# Altium schematic sheet SC_ControlV2.0.SchDoc
size A2
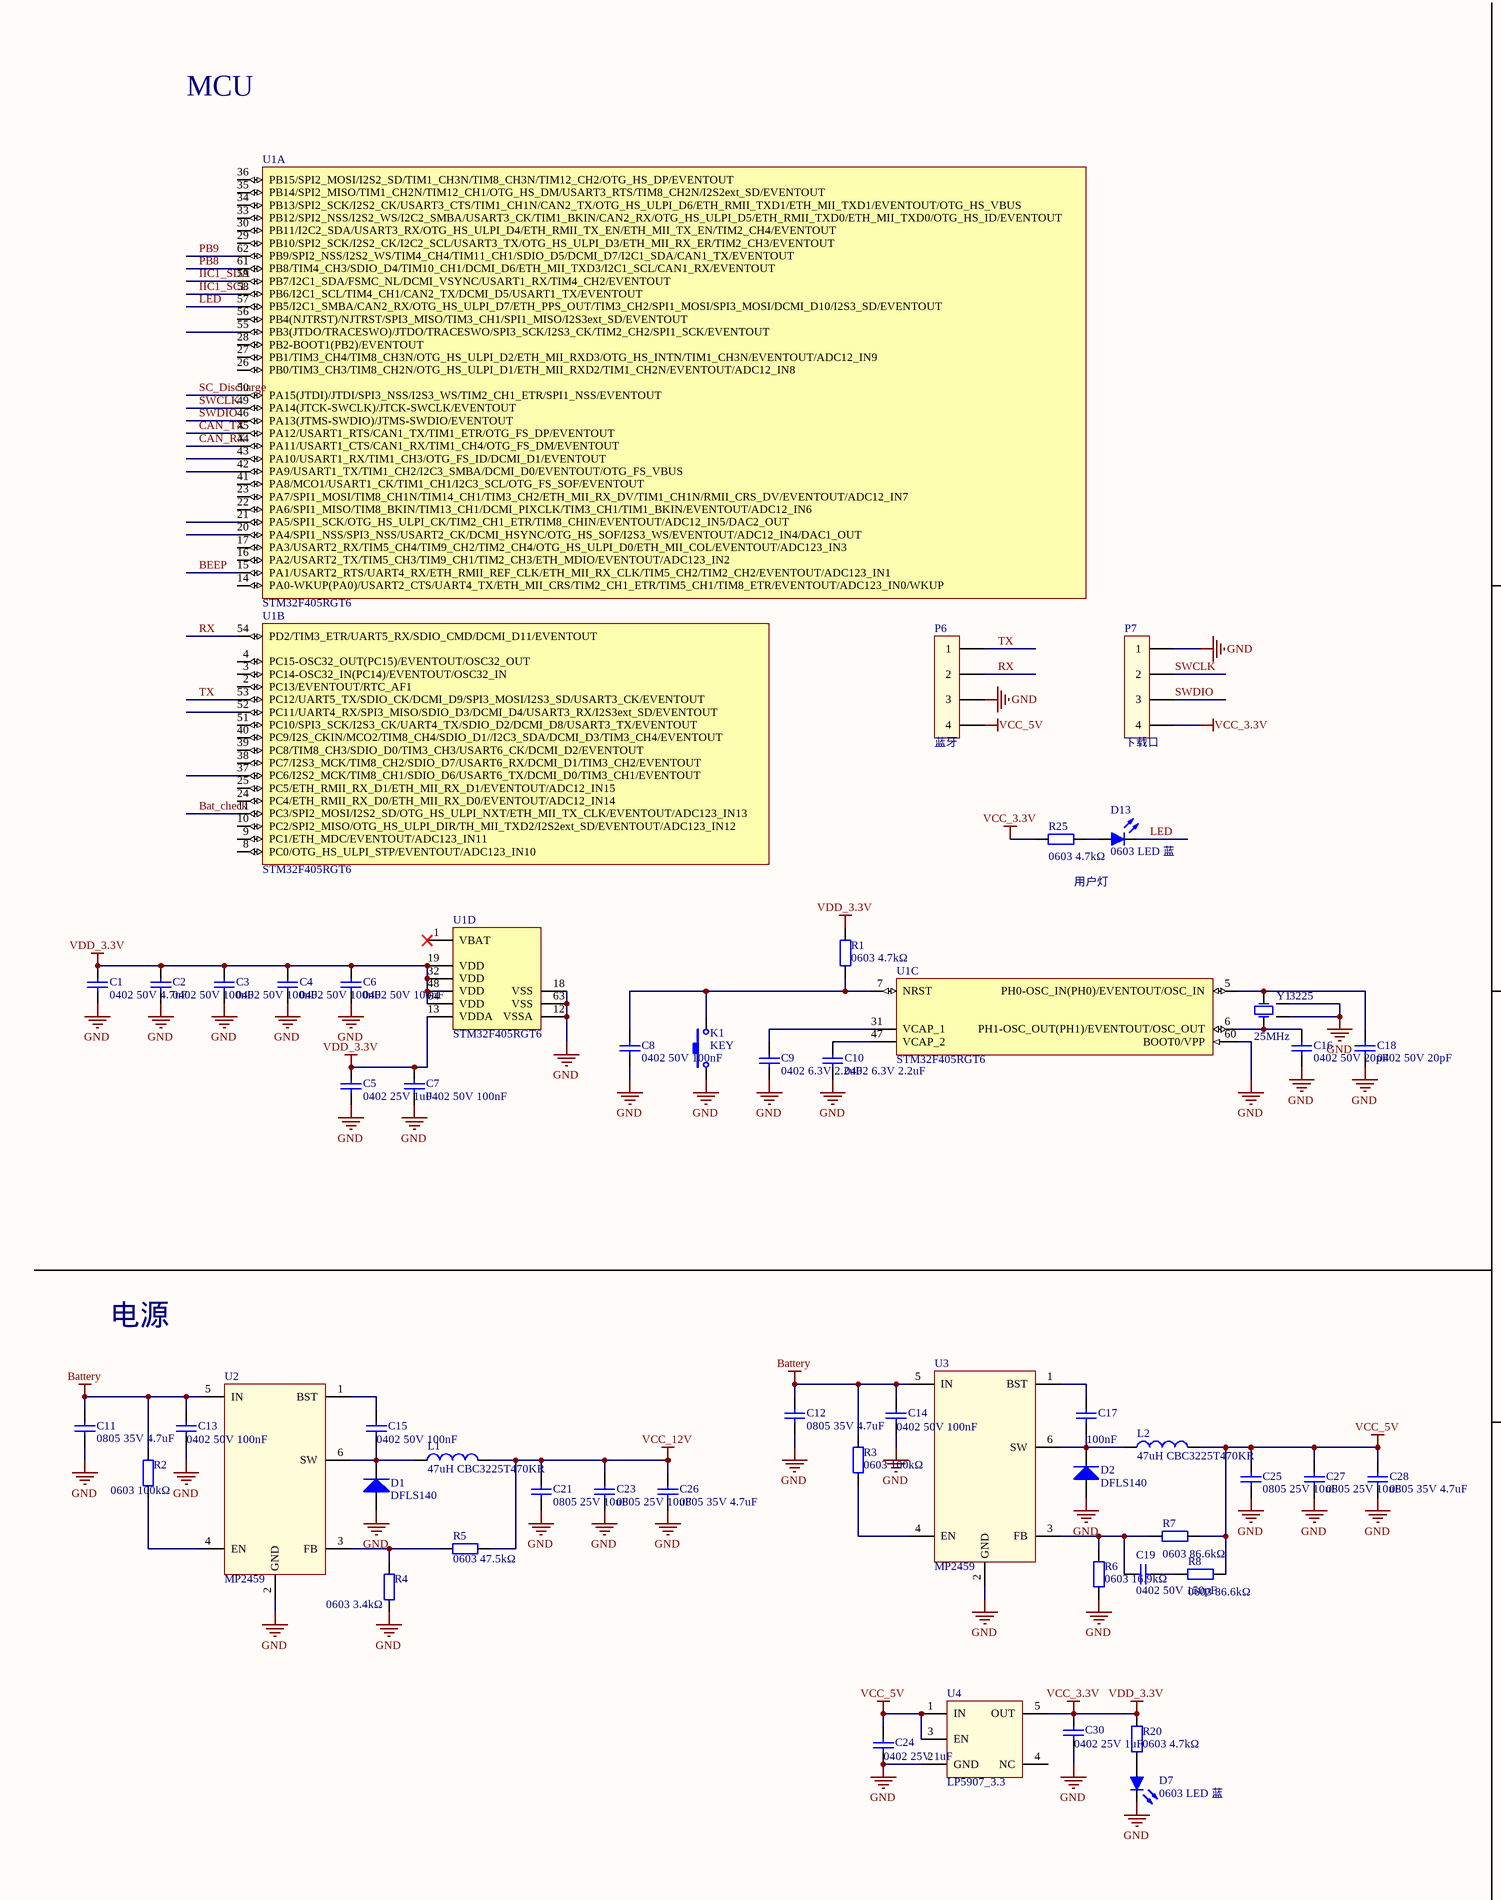
[diagram p0: SC_ControlV2.0.SchDoc, left]
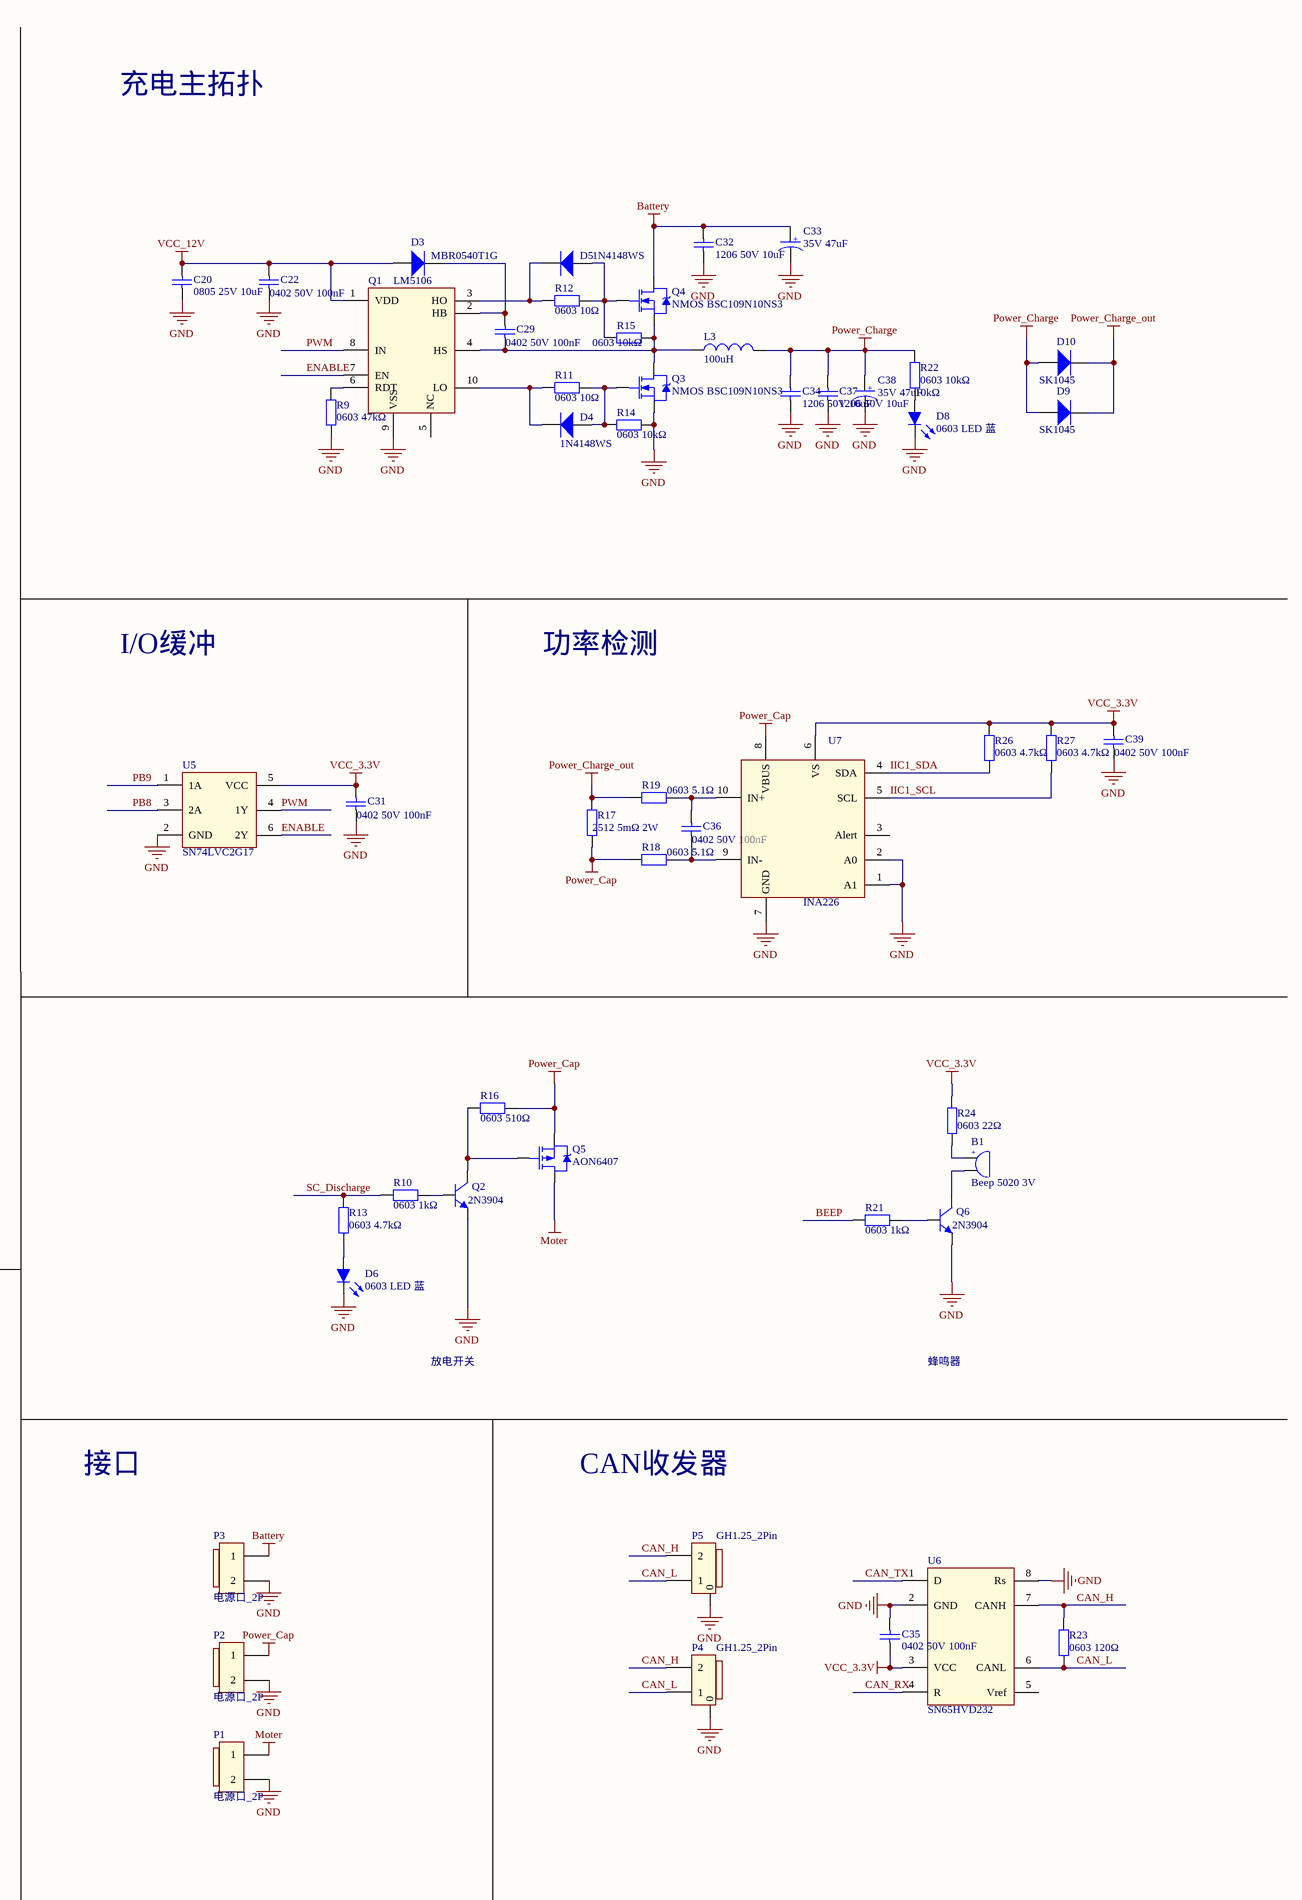
[diagram p1: SC_ControlV2.0.SchDoc, right]

## Parts
B1  Beep 5020 3V  [Beep 5020]
C1  0402 50V 4.7uF  [0402_C]
C2  0402 50V 100nF  [0402_C]
C3  0402 50V 100nF  [0402_C]
C4  0402 50V 100nF  [0402_C]
C5  0402 25V 1uF  [0402_C]
C6  0402 50V 100nF  [0402_C]
C7  0402 50V 100nF  [0402_C]
C8  0402 50V 100nF  [0402_C]
C9  0402 6.3V 2.2uF  [0402_C]
C10  0402 6.3V 2.2uF  [0402_C]
C11  0805 35V 4.7uF  [0805_C]
C12  0805 35V 4.7uF  [0805_C]
C13  0402 50V 100nF  [0402_C]
C14  0402 50V 100nF  [0402_C]
C15  0402 50V 100nF  [0402_C]
C16  0402 50V 20pF  [0402_C]
C17  Cap: 100nF  [0402_C]  (hidden comment: 0402 50V 100nF)
C18  0402 50V 20pF  [0402_C]
C19  0402 50V 150pF  [0603_C]
C20  0805 25V 10uF  [0805_C]
C21  0805 25V 10uF  [0805_C]
C22  0402 50V 100nF  [0402_C]
C23  0805 25V 10uF  [0805_C]
C24  0402 25V 1uF  [0402_C]
C25  0805 25V 10uF  [0805_C]
C26  0805 35V 4.7uF  [0805_C]
C27  0805 25V 10uF  [0805_C]
C28  0805 35V 4.7uF  [0805_C]
C29  0402 50V 100nF  [0402_C]
C30  0402 25V 1uF  [0402_C]
C31  0402 50V 100nF  [0402_C]
C32  1206 50V 10uF  [1206_C]
C33  35V 47uF  [贴片铝电解_8]
C34  1206 50V 10uF  [1206_C]
C35  0402 50V 100nF  [0402_C]
C36  0402 50V 100nF  [0402_C]
C37  1206 50V 10uF  [1206_C]
C38  35V 47uF  [贴片铝电解_8]
C39  0402 50V 100nF  [0402_C]
D1  DFLS140  [POWERDI_123]
D2  DFLS140  [POWERDI_123]
D3  MBR0540T1G  [SOD_123F]
D4  1N4148WS  [SOD_323F]
D5  1N4148WS  [SOD_323F]
D6  0603 LED 蓝  [0603_LED]
D7  0603 LED 蓝  [0603_LED]
D8  0603 LED 蓝  [0603_LED]
D9  SK1045  [SMC]
D10  SK1045  [SMC]
D13  0603 LED 蓝  [0603_LED]
K1  KEY  [按键_3*4]
L1  47uH CBC3225T470KR  [1210_L]
L2  47uH CBC3225T470KR  [1210_L]
L3  100uH  [绕线电感_14mm]
P1  电源口_2P  [电源口_2P]
P2  电源口_2P  [电源口_2P]
P3  电源口_2P  [电源口_2P]
P4  GH1.25_2Pin  [GH1.25_2Pin]
P5  GH1.25_2Pin  [GH1.25_2Pin]
P6  蓝牙  [HDR_4Pin]
P7  下载口  [HDR_4Pin]
Q1  LM5106  [VSSOP10]
Q2  2N3904  [SOT23_3]
Q3  NMOS BSC109N10NS3  [PG_TDSON_8]
Q4  NMOS BSC109N10NS3  [PG_TDSON_8]
Q5  AON6407  [DFN_5x6]
Q6  2N3904  [SOT23_3]
R1  0603 4.7kΩ  [0603 _R]
R2  0603 100kΩ  [0603 _R]
R3  0603 100kΩ  [0603 _R]
R4  0603 3.4kΩ  [0603 _R]
R5  0603 47.5kΩ  [0603 _R]
R6  0603 16.9kΩ  [0603 _R]
R7  0603 86.6kΩ  [0603 _R]
R8  0603 86.6kΩ  [0603 _R]
R9  0603 47kΩ  [0603 _R]
R10  0603 1kΩ  [0603 _R]
R11  0603 10Ω  [0603 _R]
R12  0603 10Ω  [0603 _R]
R13  0603 4.7kΩ  [0603 _R]
R14  0603 10kΩ  [0603 _R]
R15  0603 10kΩ  [0603 _R]
R16  0603 510Ω  [0603 _R]
R17  2512 5mΩ 2W  [2512_R]
R18  0603 5.1Ω  [0603 _R]
R19  0603 5.1Ω  [0603 _R]
R20  0603 4.7kΩ  [0603 _R]
R21  0603 1kΩ  [0603 _R]
R22  0603 10kΩ  Res: 10kΩ  [0603 _R]
R23  0603 120Ω  [0603 _R]
R24  0603 22Ω  [0603 _R]
R25  0603 4.7kΩ  [0603 _R]
R26  0603 4.7kΩ  [0603 _R]
R27  0603 4.7kΩ  [0603 _R]
U1  STM32F405RGT6  [LQFP64]  (parts A,B,C,D of 4)
U2  MP2459  [SOT23_6]
U3  MP2459  [SOT23_6]
U4  LP5907_3.3  [SOT23_5]
U5  SN74LVC2G17  [SOT23_6]
U6  SN65HVD232  [SOP8]
U7  INA226  [VSSOP10]
Y1  3225  无源晶振: 25MHz  [SMD-3225-4P]

## Nets
Battery: C11.1 C12.1 C13.1 C14.1 C32.1 C33.1(A) P3.1 Q4.2(D) R2.2 R3.1 U2.5(IN) U3.5(IN)
GND: C1.2 C2.2 C3.2 C4.2 C5.2 C6.2 C7.2 C8.1 C9.2 C10.2 C11.2 C12.2 C13.2 C14.2 C16.1 C18.1 C20.2 C21.2 C22.2 C23.2 C24.2 C25.2 C26.2 C27.2 C28.2 C30.2 C31.2 C32.2 C33.2 C34.2 C35.2 C37.2 C38.2 C39.2 D1.1(A) D2.1(A) D6.K D7.K D8.K K1.1 P1.2 P2.2 P3.2 P4.0 P5.0 P6.3 P7.1 Q1.9(VSS) Q2.2(E) Q3.3(S) Q6.2(E) R4.1 R6.2 R9.2 R14.1 U1.12(VSSA) U1.18(VSS) U1.60(BOOT0/VPP) U1.63(VSS) U2.2(GND) U3.2(GND) U4.2(GND) U5.2(GND) U6.2(GND) U6.8(Rs) U7.1(A1) U7.2(A0) U7.7(GND) Y1.2(GND) Y1.4(GND)
Moter: P1.1 Q5.2(D)
Power_Cap: P2.1 Q5.3(S) R16.1 R17.1 R18.2 U7.8(VBUS)
Power_Charge: C34.1 C37.1 C38.1(A) D9.1(A) D10.1(A) L3.2 R22.2
Power_Charge_out: D9.2(K) D10.2(K) R17.2 R19.2
VCC_3.3V: C1.1 C2.1 C3.1 C4.1 C5.1 C6.1 C7.1 C30.1 C31.1 C35.1 C39.1 P7.4 R1.2 R20.2 R24.1 R25.2 R26.1 R27.1 U1.13(VDDA) U1.19(VDD) U1.32(VDD) U1.48(VDD) U1.64(VDD) U4.5(OUT) U5.5(VCC) U6.3(VCC) U7.6(VS)  [also labelled VDD_3.3V]
VCC_5V: C24.1 C25.1 C27.1 C28.1 L2.2 P6.4 R7.1 R8.1 U4.1(IN) U4.3(EN)
VCC_12V: C20.1 C21.1 C22.1 C23.1 C26.1 D3.1(A) L1.2 Q1.1(VDD) R5.1
Bat_check: U1.11(PC3/SPI2_MOSI/I2S2_SD/OTG_HS_ULPI_NXT/ETH_MII_TX_CLK/EVENTOUT/ADC123_IN13)
BEEP: R21.1 U1.15(PA1/USART2_RTS/UART4_RX/ETH_RMII_REF_CLK/ETH_MII_RX_CLK/TIM5_CH2/TIM2_CH2/EVENTOUT/ADC123_IN1)
CAN_H: P4.2 P5.2 R23.1 U6.7(CANH)
CAN_L: P4.1 P5.1 R23.2 U6.6(CANL)
CAN_RX: U1.44(PA11/USART1_CTS/CAN1_RX/TIM1_CH4/OTG_FS_DM/EVENTOUT) U6.4(R)
CAN_TX: U1.45(PA12/USART1_RTS/CAN1_TX/TIM1_ETR/OTG_FS_DP/EVENTOUT) U6.1(D)
ENABLE: Q1.7(EN) U5.6(2Y)
IIC1_SCL: R27.2 U1.58(PB6/I2C1_SCL/TIM4_CH1/CAN2_TX/DCMI_D5/USART1_TX/EVENTOUT) U7.5(SCL)
IIC1_SDA: R26.2 U1.59(PB7/I2C1_SDA/FSMC_NL/DCMI_VSYNC/USART1_RX/TIM4_CH2/EVENTOUT) U7.4(SDA)
LED: D13.K U1.57(PB5/I2C1_SMBA/CAN2_RX/OTG_HS_ULPI_D7/ETH_PPS_OUT/TIM3_CH2/SPI1_MOSI/SPI3_MOSI/DCMI_D10/I2S3_SD/EVENTOUT)
PB8: U1.61(PB8/TIM4_CH3/SDIO_D4/TIM10_CH1/DCMI_D6/ETH_MII_TXD3/I2C1_SCL/CAN1_RX/EVENTOUT) U5.3(2A)
PB9: U1.62(PB9/SPI2_NSS/I2S2_WS/TIM4_CH4/TIM11_CH1/SDIO_D5/DCMI_D7/I2C1_SDA/CAN1_TX/EVENTOUT) U5.1(1A)
PWM: Q1.8(IN) U5.4(1Y)
RX: P6.2 U1.54(PD2/TIM3_ETR/UART5_RX/SDIO_CMD/DCMI_D11/EVENTOUT)
SC_Discharge: R10.2 R13.2 U1.50(PA15(JTDI)/JTDI/SPI3_NSS/I2S3_WS/TIM2_CH1_ETR/SPI1_NSS/EVENTOUT)
SWCLK: P7.2 U1.49(PA14(JTCK-SWCLK)/JTCK-SWCLK/EVENTOUT)
SWDIO: P7.3 U1.46(PA13(JTMS-SWDIO)/JTMS-SWDIO/EVENTOUT)
TX: P6.1 U1.53(PC12/UART5_TX/SDIO_CK/DCMI_D9/SPI3_MOSI/I2S3_SD/USART3_CK/EVENTOUT)
NetB1_1: B1.1 R24.2
NetB1_2: B1.2 Q6.3(C)
NetC8_2: C8.2 K1.2 R1.1 U1.7(NRST)
NetC9_1: C9.1 U1.31(VCAP_1)
NetC10_1: C10.1 U1.47(VCAP_2)
NetC15_1: C15.1 U2.1(BST)
NetC15_2: C15.2 D1.2(K) L1.1 U2.6(SW)
NetC16_2: C16.2 U1.6(PH1-OSC_OUT(PH1)/EVENTOUT/OSC_OUT) Y1.1(OSC2)
NetC17_1: C17.1 U3.1(BST)
NetC17_2: C17.2 D2.2(K) L2.1 U3.6(SW)
NetC18_2: C18.2 U1.5(PH0-OSC_IN(PH0)/EVENTOUT/OSC_IN) Y1.3(OSC1)
NetC19_1: C19.1 R6.1 R7.2 U3.3(FB)
NetC19_2: C19.2 R8.2
NetC29_1: C29.1 D3.2(K) Q1.2(HB)
NetC29_2: C29.2 L3.1 Q1.4(HS) Q3.2(D) Q4.3(S) R15.1
NetC36_1: C36.1 R19.1 U7.10(IN+)
NetC36_2: C36.2 R18.1 U7.9(IN-)
NetD4_1: D4.1(A) Q3.1(G) R11.1 R14.2
NetD4_2: D4.2(K) Q1.10(LO) R11.2
NetD5_1: D5.1(A) Q4.1(G) R12.1 R15.2
NetD5_2: D5.2(K) Q1.3(HO) R12.2
NetD6_A: D6.A R13.1
NetD7_A: D7.A R20.1
NetD8_A: D8.A R22.1
NetD13_A: D13.A R25.1
NetQ1_6: Q1.6(RDT) R9.1
NetQ2_1: Q2.1(B) R10.1
NetQ2_3: Q2.3(C) Q5.1(G) R16.2
NetQ6_1: Q6.1(B) R21.2
NetR2_1: R2.1 U2.4(EN)
NetR3_2: R3.2 U3.4(EN)
NetR4_2: R4.2 R5.2 U2.3(FB)

Not connected (* = marked no-connect by the designer): Q1 5(NC); U1 1(VBAT)* 2(PC13/EVENTOUT/RTC_AF1) 3(PC14-OSC32_IN(PC14)/EVENTOUT/OSC32_IN) 4(PC15-OSC32_OUT(PC15)/EVENTOUT/OSC32_OUT) 8(PC0/OTG_HS_ULPI_STP/EVENTOUT/ADC123_IN10) 9(PC1/ETH_MDC/EVENTOUT/ADC123_IN11) 10(PC2/SPI2_MISO/OTG_HS_ULPI_DIR/TH_MII_TXD2/I2S2ext_SD/EVENTOUT/ADC123_IN12) 14(PA0-WKUP(PA0)/USART2_CTS/UART4_TX/ETH_MII_CRS/TIM2_CH1_ETR/TIM5_CH1/TIM8_ETR/EVENTOUT/ADC123_IN0/WKUP) 16(PA2/USART2_TX/TIM5_CH3/TIM9_CH1/TIM2_CH3/ETH_MDIO/EVENTOUT/ADC123_IN2) 17(PA3/USART2_RX/TIM5_CH4/TIM9_CH2/TIM2_CH4/OTG_HS_ULPI_D0/ETH_MII_COL/EVENTOUT/ADC123_IN3) 20(PA4/SPI1_NSS/SPI3_NSS/USART2_CK/DCMI_HSYNC/OTG_HS_SOF/I2S3_WS/EVENTOUT/ADC12_IN4/DAC1_OUT) 21(PA5/SPI1_SCK/OTG_HS_ULPI_CK/TIM2_CH1_ETR/TIM8_CHIN/EVENTOUT/ADC12_IN5/DAC2_OUT) 22(PA6/SPI1_MISO/TIM8_BKIN/TIM13_CH1/DCMI_PIXCLK/TIM3_CH1/TIM1_BKIN/EVENTOUT/ADC12_IN6) 23(PA7/SPI1_MOSI/TIM8_CH1N/TIM14_CH1/TIM3_CH2/ETH_MII_RX_DV/TIM1_CH1N/RMII_CRS_DV/EVENTOUT/ADC12_IN7) 24(PC4/ETH_RMII_RX_D0/ETH_MII_RX_D0/EVENTOUT/ADC12_IN14) 25(PC5/ETH_RMII_RX_D1/ETH_MII_RX_D1/EVENTOUT/ADC12_IN15) 26(PB0/TIM3_CH3/TIM8_CH2N/OTG_HS_ULPI_D1/ETH_MII_RXD2/TIM1_CH2N/EVENTOUT/ADC12_IN8) 27(PB1/TIM3_CH4/TIM8_CH3N/OTG_HS_ULPI_D2/ETH_MII_RXD3/OTG_HS_INTN/TIM1_CH3N/EVENTOUT/ADC12_IN9) 28(PB2-BOOT1(PB2)/EVENTOUT) 29(PB10/SPI2_SCK/I2S2_CK/I2C2_SCL/USART3_TX/OTG_HS_ULPI_D3/ETH_MII_RX_ER/TIM2_CH3/EVENTOUT) 30(PB11/I2C2_SDA/USART3_RX/OTG_HS_ULPI_D4/ETH_RMII_TX_EN/ETH_MII_TX_EN/TIM2_CH4/EVENTOUT) 33(PB12/SPI2_NSS/I2S2_WS/I2C2_SMBA/USART3_CK/TIM1_BKIN/CAN2_RX/OTG_HS_ULPI_D5/ETH_RMII_TXD0/ETH_MII_TXD0/OTG_HS_ID/EVENTOUT) 34(PB13/SPI2_SCK/I2S2_CK/USART3_CTS/TIM1_CH1N/CAN2_TX/OTG_HS_ULPI_D6/ETH_RMII_TXD1/ETH_MII_TXD1/EVENTOUT/OTG_HS_VBUS) 35(PB14/SPI2_MISO/TIM1_CH2N/TIM12_CH1/OTG_HS_DM/USART3_RTS/TIM8_CH2N/I2S2ext_SD/EVENTOUT) 36(PB15/SPI2_MOSI/I2S2_SD/TIM1_CH3N/TIM8_CH3N/TIM12_CH2/OTG_HS_DP/EVENTOUT) 37(PC6/I2S2_MCK/TIM8_CH1/SDIO_D6/USART6_TX/DCMI_D0/TIM3_CH1/EVENTOUT) 38(PC7/I2S3_MCK/TIM8_CH2/SDIO_D7/USART6_RX/DCMI_D1/TIM3_CH2/EVENTOUT) 39(PC8/TIM8_CH3/SDIO_D0/TIM3_CH3/USART6_CK/DCMI_D2/EVENTOUT) 40(PC9/I2S_CKIN/MCO2/TIM8_CH4/SDIO_D1//I2C3_SDA/DCMI_D3/TIM3_CH4/EVENTOUT) 41(PA8/MCO1/USART1_CK/TIM1_CH1/I2C3_SCL/OTG_FS_SOF/EVENTOUT) 42(PA9/USART1_TX/TIM1_CH2/I2C3_SMBA/DCMI_D0/EVENTOUT/OTG_FS_VBUS) 43(PA10/USART1_RX/TIM1_CH3/OTG_FS_ID/DCMI_D1/EVENTOUT) 51(PC10/SPI3_SCK/I2S3_CK/UART4_TX/SDIO_D2/DCMI_D8/USART3_TX/EVENTOUT) 52(PC11/UART4_RX/SPI3_MISO/SDIO_D3/DCMI_D4/USART3_RX/I2S3ext_SD/EVENTOUT) 55(PB3(JTDO/TRACESWO)/JTDO/TRACESWO/SPI3_SCK/I2S3_CK/TIM2_CH2/SPI1_SCK/EVENTOUT) 56(PB4(NJTRST)/NJTRST/SPI3_MISO/TIM3_CH1/SPI1_MISO/I2S3ext_SD/EVENTOUT); U4 4(NC); U6 5(Vref); U7 3(Alert)

## Notes on the sheet
- 充电主拓扑
- MCU
- I/O缓冲
- 功率检测
- 用户灯
- 电源
- 放电开关
- 蜂鸣器
- 接口
- CAN收发器
- (in symbol Beep) +
- (in symbol 铝电解) +

## Library data of the parts
B1 = Beep
C1-C32 C34-C37 C39 = Cap
  C1 C11 C12 C26 C28: Cap: 4.7uF
  C2-C4 C6-C8 C13-C15 C22 C29 C31 C35 C36 C39: Cap: 100nF
  C5 C24 C30: Cap: 1uF
  C9 C10: Cap: 2.2uF
  C16 C18: Cap: 20pF
  C19: Cap: 150pF
  C20 C21 C23 C25 C27 C32 C34 C37: Cap: 10uF
C33 C38 = 铝电解: 固态电解: 47uF
D1-D3 D9 D10 = 肖特基二极管
D4 D5 = 开关二极管
D6-D8 D13 = LED
K1 = 按键_小
L1-L3 = 电感
P6 P7 = HDR_4Pin
Q2 Q6 = NPN
Q3 Q4 = NMOS: NMOS: BSC109N10NS3
Q5 = PMOS
R1-R16 R18-R27 = Res
  R1 R13 R20 R25-R27: Res: 4.7kΩ
  R3: Res: 100kΩ
  R6: Res: 16.9kΩ
  R7 R8: Res: 86.6kΩ
  R9: Res: 47kΩ
  R10 R21: Res: 1kΩ
  R11 R12: Res: 10Ω
  R14 R15: Res: 10kΩ
  R16: Res: 510Ω
  R18 R19: Res: 5.1Ω
  R23: Res: 120Ω
  R24: Res: 22Ω
R17 = Res: Res: 5mR
U4 = LP5907
Y1 = 无源晶振_4Pin
U1 = STM32F405RGT6: ComponentLink1Description: 供应商链接; ComponentLink1URL: http://www.szlcsc.com/product/details_16424.html; Package: LQFP-64_10x10x05P; Supplier: LC; SuppliersPartNumber: C15742